# Altium schematic sheet Sheet1.SchDoc
size A
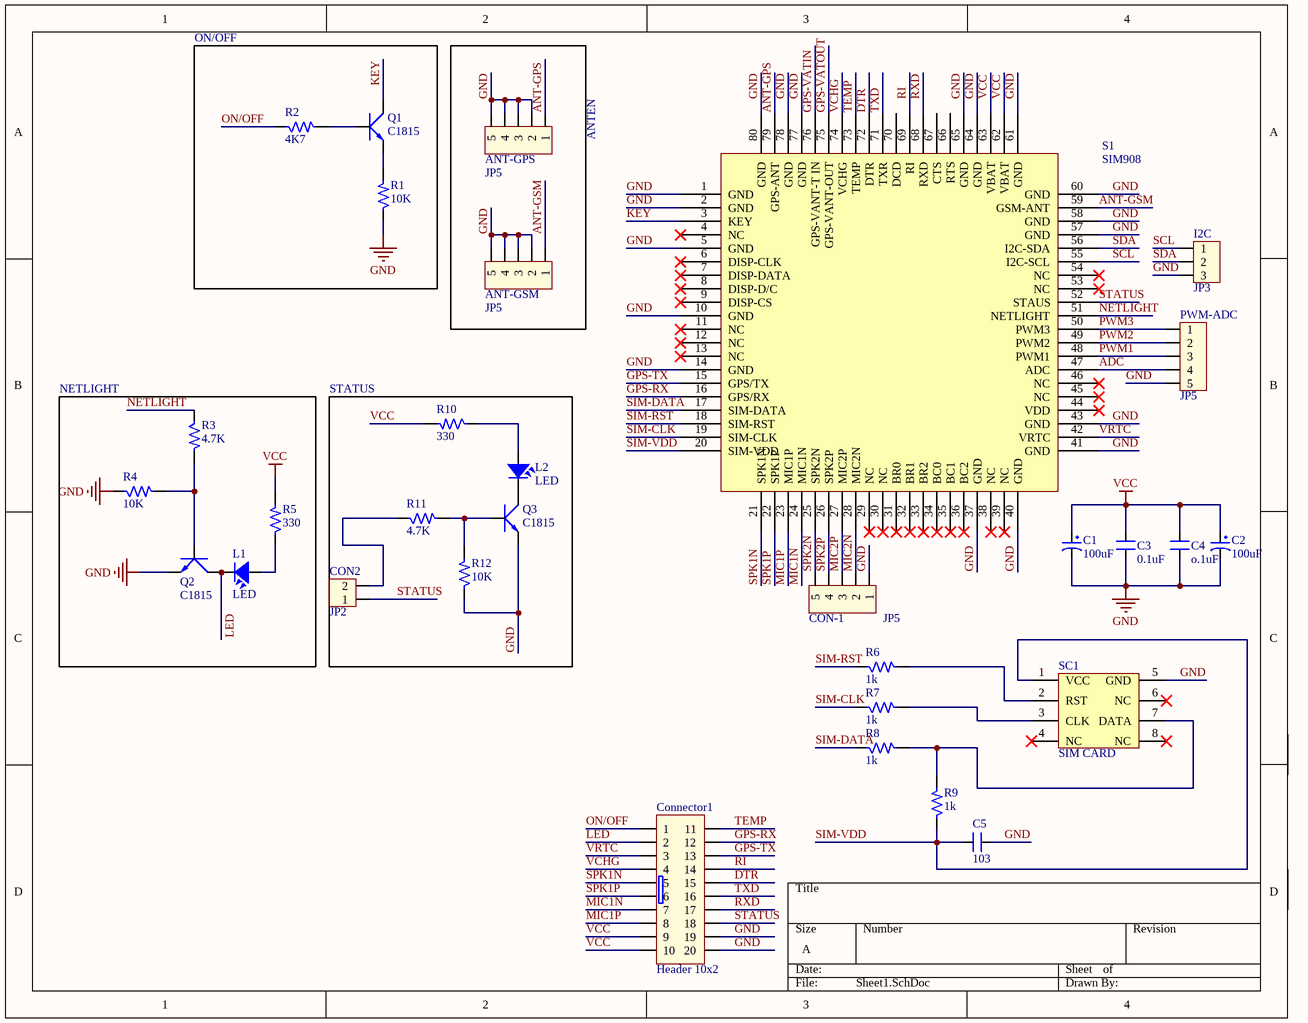
[diagram p0: Sheet1.SchDoc]

## Parts
ANT-GPS  JP5  [MCX5.08-H5]
ANT-GSM  JP5  [MCX5.08-H5]
C1  100uF  [CAP-D8-220uF/16V]
C2  100uF  [CAP-D8-220uF/16V]
C3  0.1uF  [SM-0805]
C4  o.1uF  [SM-0805]
C5  103  [SM-0805]
CON2  JP2  [CON2]
CON-1  JP5  [CON5]
Connector1  Header 10x2  [Hed2X10]
I2C  JP3  [CON3]
L1  LED  [SM-1206]
L2  LED  [LED-3]
PWM-ADC  JP5  [CON5]
Q1  C1815  [2N2222]
Q2  C1815  [2N2222]
Q3  C1815  [QTO-92]
R1  10K  [SM-0805]
R2  4K7  [SM-0805]
R3  4.7K  [SM-0805]
R4  10K  [SM-0805]
R5  330  [SM-0805]
R6  1k  [SM-0805]
R7  1k  [SM-0805]
R8  1k  [SM-0805]
R9  1k  [SM-0805]
R10  330  [R1/4W]
R11  4.7K  [R1/4W]
R12  10K  [R1/4W]
S1  SIM908  [SIM908]
SC1  SIM CARD  [SIM CARD]

## Blocks framed on the sheet
ON/OFF: Q1 R1 R2
NETLIGHT: L1 Q2 R3-R5
STATUS: CON2 L2 Q3 R10-R12

## Nets
GND: ANT-GPS.2 ANT-GPS.3 ANT-GPS.4 ANT-GPS.5 ANT-GSM.2 ANT-GSM.3 ANT-GSM.4 ANT-GSM.5 C1.2 C2.2 C3.1 C4.1 C5.2 CON-1.1 Connector1.19 Connector1.20 I2C.3 PWM-ADC.5 Q2.1(E) Q3.1(E) R1.1 R4.1 R12.1 S1.1(GND) S1.2(GND) S1.5(GND) S1.10(GND) S1.14(GND) S1.37(GND) S1.40(GND) S1.41(GND) S1.43(GND) S1.57(GND) S1.58(GND) S1.60(GND) S1.61(GND) S1.64(GND) S1.65(GND) S1.77(GND) S1.78(GND) S1.80(GND) SC1.5(GND)
VCC: C1.1 C2.1 C3.2 C4.2 Connector1.9 Connector1.10 R5.2 R10.2 S1.62(VBAT) S1.63(VBAT)
ADC: PWM-ADC.4 S1.47(ADC)
ANT-GPS: ANT-GPS.1 S1.79(GPS-ANT)
ANT-GSM: ANT-GSM.1 S1.59(GSM-ANT)
DTR: Connector1.15 S1.72(DTR)
GPS-RX: Connector1.12 S1.16(GPS/RX)
GPS-TX: Connector1.13 S1.15(GPS/TX)
GPS-VATIN: S1.76(GPS-VANT-T_IN)
GPS-VATOUT: S1.75(GPS-VANT-OUT)
KEY: Q1.2(C) S1.3(KEY)
LED: Connector1.2 L1.2 Q2.2(C)
MIC1N: Connector1.7 S1.24(MIC1N)
MIC1P: Connector1.8 S1.23(MIC1P)
MIC2N: CON-1.2 S1.28(MIC2N)
MIC2P: CON-1.3 S1.27(MIC2P)
NETLIGHT: R3.1 S1.51(NETLIGHT)
ON/OFF: Connector1.1 R2.1
PWM1: PWM-ADC.3 S1.48(PWM1)
PWM2: PWM-ADC.2 S1.49(PWM2)
PWM3: PWM-ADC.1 S1.50(PWM3)
RI: Connector1.14 S1.69(RI)
RXD: Connector1.17 S1.68(RXD)
SCL: I2C.1 S1.55(I2C-SCL)
SDA: I2C.2 S1.56(I2C-SDA)
SIM-CLK: R7.1 S1.19(SIM-CLK)
SIM-DATA: R8.1 S1.17(SIM-DATA)
SIM-RST: R6.1 S1.18(SIM-RST)
SIM-VDD: C5.1 R9.1 S1.20(SIM-VDD) SC1.1(VCC)
SPK1N: Connector1.5 S1.21(SPK1N)
SPK1P: Connector1.6 S1.22(SPK1P)
SPK2N: CON-1.5 S1.25(SPK2N)
SPK2P: CON-1.4 S1.26(SPK2P)
STATUS: CON2.1 Connector1.18 S1.52(STAUS)
TEMP: Connector1.11 S1.73(TEMP)
TXD: Connector1.16 S1.71(TXR)
VCHG: Connector1.4 S1.74(VCHG)
VRTC: Connector1.3 S1.42(VRTC)
NetCON2_2: CON2.2 R11.1
NetL1_1: L1.1 R5.1
NetL2_1: L2.1 R10.1
NetL2_2: L2.2 Q3.2(C)
NetQ1_1: Q1.1(E) R1.2
NetQ1_3: Q1.3(B) R2.2
NetQ2_3: Q2.3(B) R3.2 R4.2
NetQ3_3: Q3.3(B) R11.2 R12.2
NetR6_2: R6.2 SC1.2(RST)
NetR7_2: R7.2 SC1.3(CLK)
NetR8_2: R8.2 R9.2 SC1.7(DATA)

Not connected (* = marked no-connect by the designer): S1 4(NC)* 6(DISP-CLK)* 7(DISP-DATA)* 8(DISP-D/C)* 9(DISP-CS)* 11(NC)* 12(NC)* 13(NC)* 29(NC)* 30(NC)* 31(BR0)* 32(BR1)* 33(BR2)* 34(BC0)* 35(BC1)* 36(BC2)* 38(NC)* 39(NC)* 44(VDD)* 45(NC)* 46(NC)* 53(NC)* 54(NC)* 66(RTS) 67(CTS) 70(DCD); SC1 4(NC)* 6(NC)* 8(NC)*

## Notes on the sheet
- (near ANT-GPS) ANTEN

## Library data of the parts
ANT-GPS ANT-GSM CON-1 PWM-ADC = Con5: Connector 5; Value: Connector 5
C1 C2 = CP9: Cap 10000uF/63V; Value: 220uF/450V
C3 C4 = CM: Cap SMD; Value: 103
C5 = CM: Cap SMD; Value: 103
CON2 = Con2: Connector 2; Value: Connector 2
Connector1 = HED10X2: Value: Header 5x2
I2C = Con3: Connector 3; Value: Connector 3
L1 L2 = LED: LED Single colour Green and Red; Value: LED 3 ly Single Colour
Q1-Q3 = C1815: NPN 600mW, ECB; Value: C1815
R1-R12 = R: Resistor 1/4W; Value: R1/4W - 1K